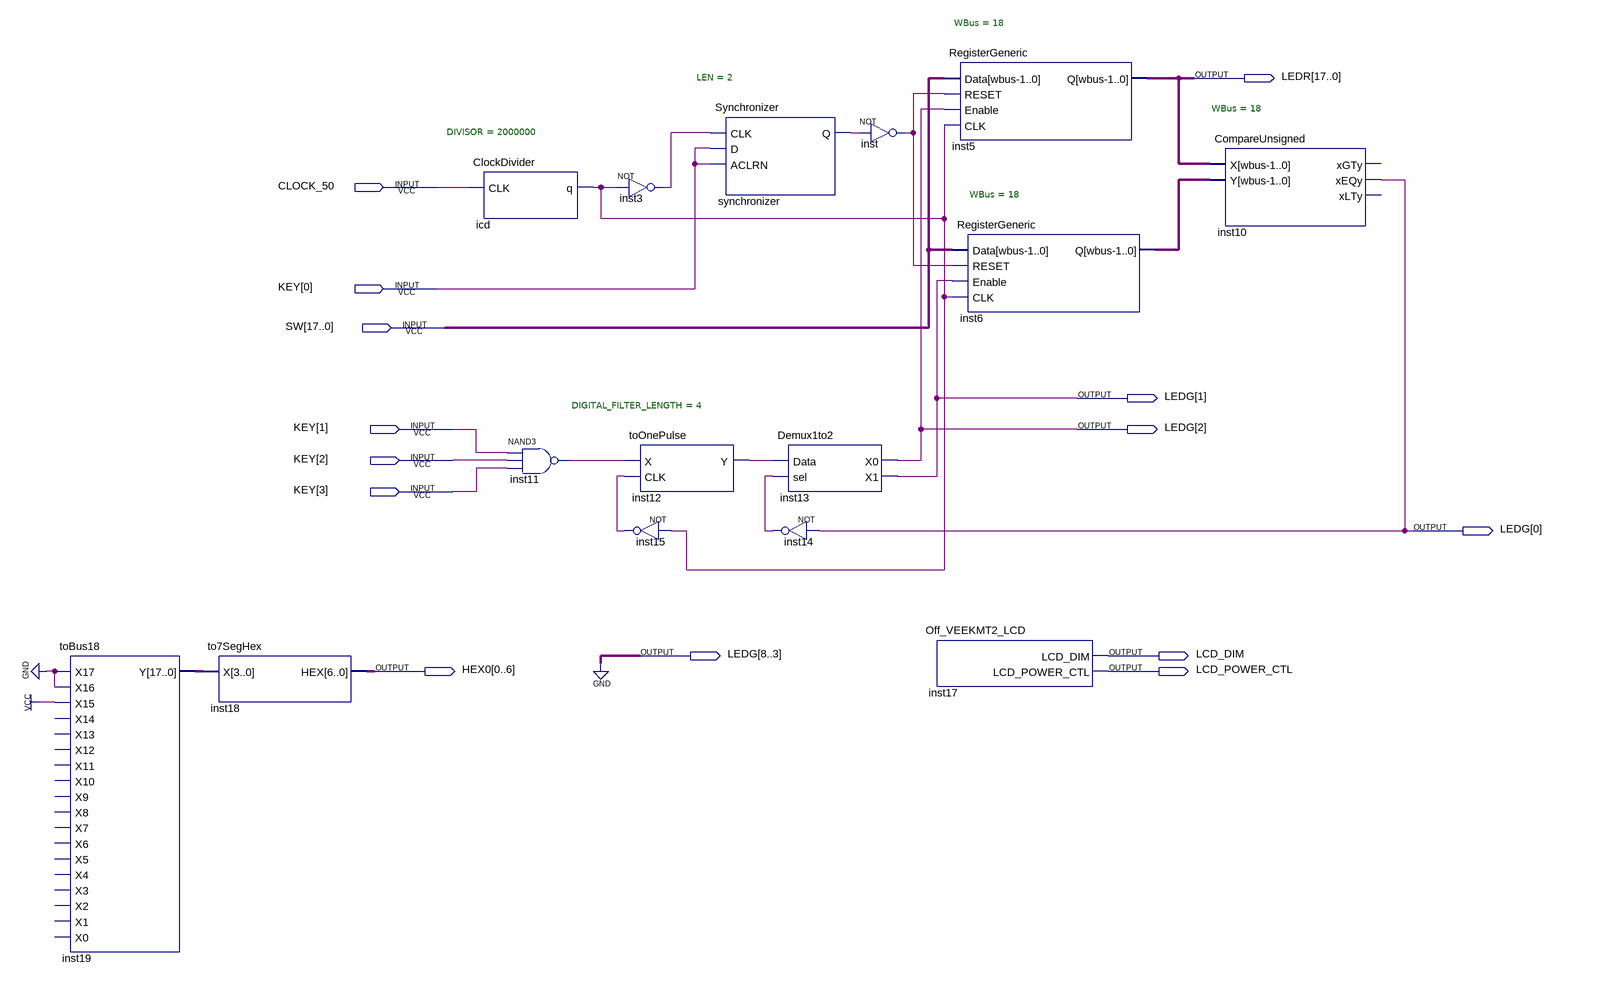
[diagram p0: schematic sheet]
// Quartus schematic lock.bdf as structural Verilog: 15 symbols, 14 pins
module lock (
  input  CLOCK_50,
  input  [3:0] KEY,
  input  [17:0] SW,
  output [17:0] LEDR,
  output [8:0] LEDG,
  output LCD_DIM,
  output [0:6] HEX0,
  output LCD_POWER_CTL
);

  wire icd_q, inst3_out, inst11_out, inst12_y, inst14_out, inst15_out, inst_out, synchronizer_q;
  wire [17:0] inst6_q, inst19_y;

  toBus18 inst19 (
    .X17(1'b0), .X16(1'b0), .X15(1'b1), .Y(inst19_y));  // open: X14, X13, X12, X11, X10, X9, X8, X7, X6, X5, X4, X3, X2, X1, X0
  to7SegHex inst18 (.X(inst19_y), .HEX(HEX0));
  ClockDivider #(.DIVISOR(2000000)) icd (.CLK(CLOCK_50), .q(icd_q));
  nand inst11 (inst11_out, KEY[1], KEY[2], KEY[3]);
  not inst3 (inst3_out, icd_q);
  toOnePulse #(.DIGITAL_FILTER_LENGTH(4)) inst12 (.X(inst11_out), .CLK(inst15_out), .Y(inst12_y));
  not inst15 (inst15_out, icd_q);
  Synchronizer #(.LEN(2)) synchronizer (.CLK(inst3_out), .D(KEY[0]), .ACLRN(KEY[0]), .Q(synchronizer_q));
  Demux1to2 inst13 (.Data(inst12_y), .sel(inst14_out), .X0(LEDG[2]), .X1(LEDG[1]));
  not inst14 (inst14_out, LEDG[0]);
  not inst (inst_out, synchronizer_q);
  RegisterGeneric #(.WBus(18)) inst5 (.Data(SW), .RESET(inst_out), .Enable(LEDG[2]), .CLK(icd_q), .Q(LEDR));
  RegisterGeneric #(.WBus(18)) inst6 (.Data(SW), .RESET(inst_out), .Enable(LEDG[1]), .CLK(icd_q), .Q(inst6_q));
  Off_VEEKMT2_LCD inst17 (.LCD_DIM(LCD_DIM), .LCD_POWER_CTL(LCD_POWER_CTL));
  CompareUnsigned #(.WBus(18)) inst10 (.X(LEDR), .Y(inst6_q), .xEQy(LEDG[0]));  // open: xGTy, xLTy

  assign LEDG[8:3] = {6{1'b0}};
endmodule
